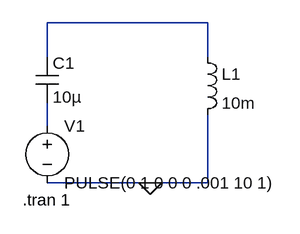
[diagram p0: schematic LC resonnance.asc]
LC resonnance.asc, the LTspice schematic file:
Version 4
SHEET 1 880 680
WIRE 256 80 32 80
WIRE 32 128 32 80
WIRE 256 128 256 80
WIRE 32 224 32 192
WIRE 176 304 32 304
WIRE 256 304 256 208
WIRE 256 304 176 304
FLAG 176 304 0
SYMBOL cap 16 128 R0
SYMATTR InstName C1
SYMATTR Value 10µ
SYMBOL ind 240 112 R0
SYMATTR InstName L1
SYMATTR Value 10m
SYMBOL voltage 32 208 R0
WINDOW 123 0 0 Left 0
WINDOW 39 0 0 Left 0
SYMATTR InstName V1
SYMATTR Value PULSE(0 1 0 0 0 .001 10 1)
TEXT -2 328 Left 2 !.tran 1

The netlist it stands for:
* LC resonnance.asc
C1 N001 N002 10µ
L1 N001 0 10m
V1 N002 0 PULSE(0 1 0 0 0 .001 10 1)
.tran 1
.backanno
.end